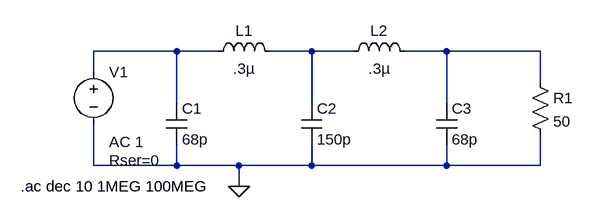
[diagram p0: schematic LP_Filter.asc]
LP_Filter.asc, the LTspice schematic file:
Version 4
SHEET 1 880 680
WIRE 80 112 -48 112
WIRE 144 112 80 112
WIRE 288 112 224 112
WIRE 352 112 288 112
WIRE 496 112 432 112
WIRE 640 112 496 112
WIRE -48 144 -48 112
WIRE 640 160 640 112
WIRE 80 192 80 112
WIRE 288 192 288 112
WIRE 496 192 496 112
WIRE -48 288 -48 224
WIRE 80 288 80 256
WIRE 80 288 -48 288
WIRE 176 288 80 288
WIRE 288 288 288 256
WIRE 288 288 176 288
WIRE 496 288 496 256
WIRE 496 288 288 288
WIRE 640 288 640 240
WIRE 640 288 496 288
WIRE 176 320 176 288
FLAG 176 320 0
SYMBOL ind 128 128 R270
WINDOW 0 32 56 VTop 2
WINDOW 3 5 56 VBottom 2
SYMATTR InstName L1
SYMATTR Value .3µ
SYMBOL ind 336 128 R270
WINDOW 0 32 56 VTop 2
WINDOW 3 5 56 VBottom 2
SYMATTR InstName L2
SYMATTR Value .3µ
SYMBOL cap 64 192 R0
SYMATTR InstName C1
SYMATTR Value 68p
SYMBOL cap 272 192 R0
SYMATTR InstName C2
SYMATTR Value 150p
SYMBOL cap 480 192 R0
SYMATTR InstName C3
SYMATTR Value 68p
SYMBOL voltage -48 128 R0
WINDOW 123 24 124 Left 2
WINDOW 39 24 152 Left 2
SYMATTR InstName V1
SYMATTR Value ""
SYMATTR Value2 AC 1
SYMATTR SpiceLine Rser=0
SYMBOL res 624 144 R0
SYMATTR InstName R1
SYMATTR Value 50
TEXT -160 320 Left 2 !.ac dec 10 1MEG 100MEG

The netlist it stands for:
* LP_Filter.asc
L1 N001 N002 .3µ
L2 N002 N003 .3µ
C1 N001 0 68p
C2 N002 0 150p
C3 N003 0 68p
V1 N001 0 AC 1 Rser=0
R1 N003 0 50
.ac dec 10 1MEG 100MEG
.backanno
.end